# Altium schematic sheet ZYNQ_SOC_JTAG.SchDoc
size A4
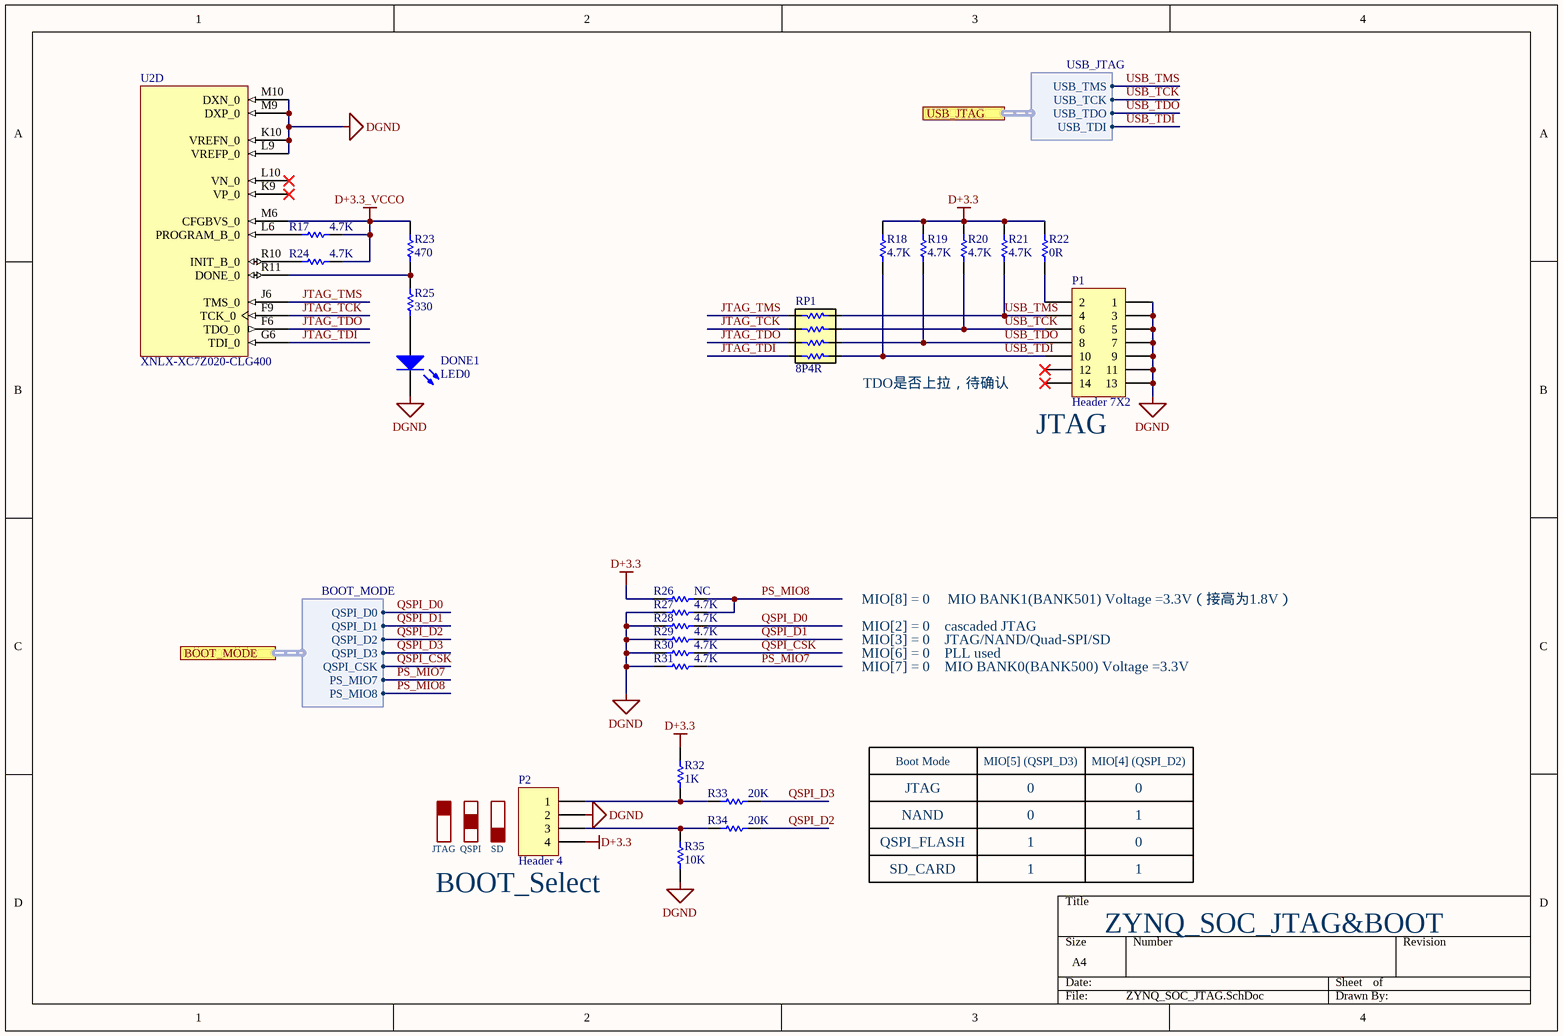
[diagram p0: ZYNQ_SOC_JTAG.SchDoc]

## Parts
DONE1  LED0  [LED 0603G]
P1  Header 7X2  [IDC2.54-LI-2x7P]
P2  Header 4  [HDR1X4]
R17  4.7K  [R 0402_L]
R18  4.7K  [R 0603_L]
R19  4.7K  [R 0603_L]
R20  4.7K  [R 0603_L]
R21  4.7K  [R 0603_L]
R22  0R  [R 0603_L]
R23  470  [R 0603_L]
R24  4.7K  [R 0402_L]
R25  330  [R 0603_L]
R26  NC  [R 0402_L]
R27  4.7K  [R 0402_L]
R28  4.7K  [R 0402_L]
R29  4.7K  [R 0402_L]
R30  4.7K  [R 0402_L]
R31  4.7K  [R 0402_L]
R32  1K  [R 0603_L]
R33  20K  [R 0603_L]
R34  20K  [R 0603_L]
R35  10K  [R 0603_L]
RP1  8P4R  [8P4R]
U2  XNLX-XC7Z020-CLG400  [BGA400]  (part D of 9)

## Ports
BOOT_MODE (harness BOOT_MODE), USB_JTAG (harness USB_JTAG)

## Harnesses
BOOT_MODE: QSPI_D0, QSPI_D1, QSPI_D3, QSPI_CSK, PS_MIO7, QSPI_D2, PS_MIO8
USB_JTAG: USB_TMS, USB_TCK, USB_TDI, USB_TDO

## Nets
D+3.3: P2.4 R18.2 R19.2 R20.2 R21.2 R22.2 R26.1 R32.2
D+3.3_VCCO: R17.2 R23.2 R24.2 U2.M6(CFGBVS_0)
DGND: DONE1.2(K) P1.1 P1.3 P1.5 P1.7 P1.9 P1.11 P1.13 P2.2 R27.1 R28.1 R29.1 R30.1 R31.1 R35.1 U2.K10(VREFN_0) U2.L9(VREFP_0) U2.M9(DXP_0) U2.M10(DXN_0)
JTAG_TCK: RP1.3 U2.F9(TCK_0)
JTAG_TDI: RP1.1 U2.G6(TDI_0)
JTAG_TDO: RP1.2 U2.F6(TDO_0)
JTAG_TMS: RP1.4 U2.J6(TMS_0)
PS_MIO7: R31.2 ; port BOOT_MODE.PS_MIO7
PS_MIO8: R26.2 R27.2 ; port BOOT_MODE.PS_MIO8
QSPI_CSK: R30.2 ; port BOOT_MODE.QSPI_CSK
QSPI_D0: R28.2 ; port BOOT_MODE.QSPI_D0
QSPI_D1: R29.2 ; port BOOT_MODE.QSPI_D1
QSPI_D2: R34.2 ; port BOOT_MODE.QSPI_D2
QSPI_D3: R33.2 ; port BOOT_MODE.QSPI_D3
USB_TCK: P1.6 R20.1 RP1.7 ; port USB_JTAG.USB_TCK
USB_TDI: P1.10 R18.1 RP1.5 ; port USB_JTAG.USB_TDI
USB_TDO: P1.8 R19.1 RP1.6 ; port USB_JTAG.USB_TDO
USB_TMS: P1.4 R21.1 RP1.8 ; port USB_JTAG.USB_TMS
NetDONE1_1: DONE1.1(A) R25.1
NetP1_2: P1.2 R22.1
NetP2_1: P2.1 R32.1 R33.1
NetP2_3: P2.3 R34.1 R35.2
NetR17_1: R17.1 U2.L6(PROGRAM_B_0)
NetR23_1: R23.1 R25.2 U2.R11(DONE_0)
NetR24_1: R24.1 U2.R10(INIT_B_0)

Not connected (* = marked no-connect by the designer): P1 12* 14*; U2 K9(VP_0)* L10(VN_0)*

## Notes on the sheet
- TDO是否上拉，待确认
- (near P1) JTAG
- MIO[2] = 0
- MIO[3] = 0
- MIO[6] = 0
- MIO[8] = 0
- PLL used
- cascaded JTAG
- JTAG/NAND/Quad-SPI/SD
- MIO BANK1(BANK501) Voltage =3.3V（接高为1.8V）
- MIO[7] = 0
- MIO BANK0(BANK500) Voltage =3.3V
- Boot Mode
- JTAG
- MIO[5] (QSPI_D3)
- 0
- MIO[4] (QSPI_D2)
- QSPI
- SD
- NAND
- QSPI_FLASH
- 1
- (near P2) BOOT_Select
- SD_CARD
- ZYNQ_SOC_JTAG&BOOT

## Library data of the parts
DONE1 = LED0: Typical INFRARED GaAs LED; Published: 8-Jun-2000; LatestRevisionDate: 08-Jul-2005; LatestRevisionNote: Mech Layer 1 removed.; PackageReference: LED-0; Publisher: Altium Limited; PackageDescription: LED; 2 Leads
P1 = Header 7X2: Header, 7-Pin, Dual row; LatestRevisionDate: 17-Jul-2002; LatestRevisionNote: Re-released for DXP Platform.; Publisher: Altium Limited
P2 = Header 4: Header, 4-Pin; LatestRevisionDate: 17-Jul-2002; LatestRevisionNote: Re-released for DXP Platform.; Publisher: Altium Limited
R17-R31 R33-R35 = Res1: Resistor; Value: 1K; Published: 8-Jun-2000; LatestRevisionDate: 17-Jul-2002; LatestRevisionNote: Re-released for DXP Platform.; PackageReference: AXIAL-0.3; Publisher: Altium Limited; PackageDescription: Axial Device, Thru-Hole; 2 Leads; 0.3 in Pin Spacing
R32 = Res1: Resistor; Published: 8-Jun-2000; LatestRevisionDate: 17-Jul-2002; LatestRevisionNote: Re-released for DXP Platform.; PackageReference: AXIAL-0.3; Publisher: Altium Limited; PackageDescription: Axial Device, Thru-Hole; 2 Leads; 0.3 in Pin Spacing; Value: 1K
RP1 = 8P4R: 贴片排阻; Manufacturer: NC; value: NC
U2 = XNLX-XC7Z020-CLG400: xilinx双核A9处理器与FPGA集成的SoC; Manufacturer: xilinx; value: NC